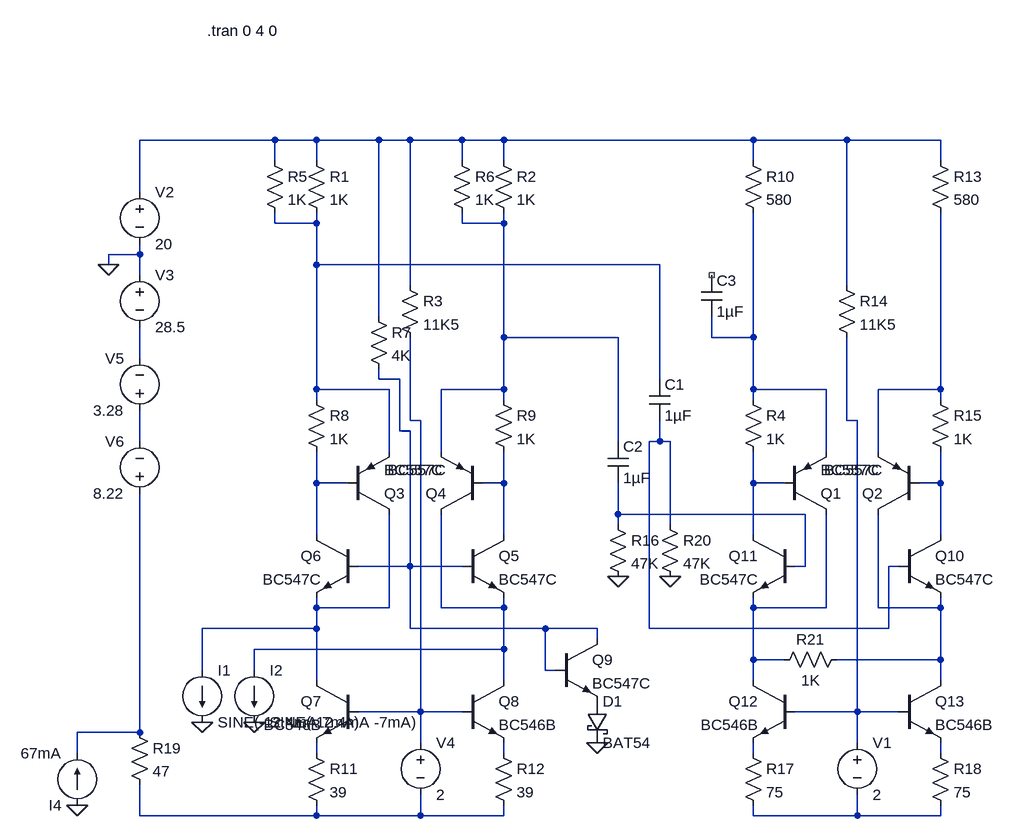
[diagram p0: schematic Untitled.asc]
Untitled.asc, the LTspice schematic file:
Version 4
SHEET 1 1396 1156
WIRE 96 32 -112 32
WIRE 160 32 96 32
WIRE 256 32 160 32
WIRE 304 32 256 32
WIRE 384 32 304 32
WIRE 448 32 384 32
WIRE 832 32 448 32
WIRE 976 32 832 32
WIRE 1120 32 976 32
WIRE 96 64 96 32
WIRE 160 64 160 32
WIRE 384 64 384 32
WIRE 448 64 448 32
WIRE 832 64 832 32
WIRE 1120 64 1120 32
WIRE -112 112 -112 32
WIRE 96 160 96 144
WIRE 160 160 160 144
WIRE 160 160 96 160
WIRE 384 160 384 144
WIRE 448 160 448 144
WIRE 448 160 384 160
WIRE -112 208 -112 192
WIRE -112 208 -160 208
WIRE -160 224 -160 208
WIRE 160 224 160 160
WIRE 688 224 160 224
WIRE -112 240 -112 208
WIRE 304 256 304 32
WIRE 976 256 976 32
WIRE 256 304 256 32
WIRE 448 336 448 160
WIRE 624 336 448 336
WIRE 768 336 768 304
WIRE 832 336 832 144
WIRE 832 336 768 336
WIRE -112 368 -112 320
WIRE 256 400 256 384
WIRE 288 400 256 400
WIRE 688 400 688 224
WIRE 160 416 160 224
WIRE 272 416 160 416
WIRE 448 416 448 336
WIRE 448 416 352 416
WIRE 832 416 832 336
WIRE 944 416 832 416
WIRE 1120 416 1120 144
WIRE 1120 416 1024 416
WIRE 160 432 160 416
WIRE 448 432 448 416
WIRE 832 432 832 416
WIRE 1120 432 1120 416
WIRE 304 464 304 336
WIRE 320 464 304 464
WIRE 976 464 976 336
WIRE 992 464 976 464
WIRE 288 480 288 400
WIRE 304 480 288 480
WIRE -112 496 -112 448
WIRE 624 496 624 336
WIRE 688 496 688 464
WIRE 688 496 672 496
WIRE 704 496 688 496
WIRE 272 512 272 416
WIRE 352 512 352 416
WIRE 944 512 944 416
WIRE 1024 512 1024 416
WIRE 160 560 160 512
WIRE 208 560 160 560
WIRE 448 560 448 512
WIRE 448 560 416 560
WIRE 832 560 832 512
WIRE 880 560 832 560
WIRE 1120 560 1120 512
WIRE 1120 560 1088 560
WIRE 624 608 624 560
WIRE 912 608 624 608
WIRE 624 624 624 608
WIRE 704 624 704 496
WIRE 160 640 160 560
WIRE 448 640 448 560
WIRE 832 640 832 560
WIRE 1120 640 1120 560
WIRE 304 688 304 480
WIRE 304 688 224 688
WIRE 384 688 304 688
WIRE 912 688 912 608
WIRE 912 688 896 688
WIRE 1056 688 1040 688
WIRE 160 752 160 736
WIRE 272 752 272 608
WIRE 272 752 160 752
WIRE 352 752 352 608
WIRE 448 752 448 736
WIRE 448 752 352 752
WIRE 832 752 832 736
WIRE 944 752 944 608
WIRE 944 752 832 752
WIRE 1024 752 1024 608
WIRE 1120 752 1120 736
WIRE 1120 752 1024 752
WIRE 160 784 160 752
WIRE 160 784 -16 784
WIRE 304 784 304 688
WIRE 512 784 304 784
WIRE 592 784 512 784
WIRE 672 784 672 496
WIRE 1040 784 1040 688
WIRE 1040 784 672 784
WIRE 592 800 592 784
WIRE 448 816 448 752
WIRE 448 816 64 816
WIRE 832 832 832 752
WIRE 880 832 832 832
WIRE 1120 832 1120 752
WIRE 1120 832 960 832
WIRE -16 848 -16 784
WIRE 64 848 64 816
WIRE 512 848 512 784
WIRE 528 848 512 848
WIRE 160 864 160 784
WIRE 448 864 448 816
WIRE 832 864 832 832
WIRE 1120 864 1120 832
WIRE 320 912 320 464
WIRE 320 912 224 912
WIRE 384 912 320 912
WIRE 992 912 992 464
WIRE 992 912 896 912
WIRE 1056 912 992 912
WIRE -112 944 -112 576
WIRE -112 944 -208 944
WIRE 320 960 320 912
WIRE 992 960 992 912
WIRE -208 976 -208 944
WIRE 160 976 160 960
WIRE 448 976 448 960
WIRE 832 976 832 960
WIRE 1120 976 1120 960
WIRE -112 1072 -112 1024
WIRE 160 1072 160 1056
WIRE 160 1072 -112 1072
WIRE 320 1072 320 1040
WIRE 320 1072 160 1072
WIRE 448 1072 448 1056
WIRE 448 1072 320 1072
WIRE 832 1072 832 1056
WIRE 992 1072 992 1040
WIRE 992 1072 832 1072
WIRE 1120 1072 1120 1056
WIRE 1120 1072 992 1072
FLAG -160 224 0
FLAG -16 928 0
FLAG 64 928 0
FLAG 592 960 0
FLAG 624 704 0
FLAG 704 704 0
FLAG -208 1056 0
SYMBOL res 144 48 R0
SYMATTR InstName R1
SYMATTR Value 1K
SYMBOL res 432 48 R0
SYMATTR InstName R2
SYMATTR Value 1K
SYMBOL res 288 240 R0
SYMATTR InstName R3
SYMATTR Value 11K5
SYMBOL voltage -112 96 R0
SYMATTR InstName V2
SYMATTR Value 20
SYMBOL voltage -112 224 R0
SYMATTR InstName V3
SYMATTR Value 28.5
SYMBOL res 144 416 R0
SYMATTR InstName R8
SYMATTR Value 1K
SYMBOL res 432 416 R0
SYMATTR InstName R9
SYMATTR Value 1K
SYMBOL pnp 208 608 M180
SYMATTR InstName Q3
SYMATTR Value BC557C
SYMBOL pnp 416 608 R180
SYMATTR InstName Q4
SYMATTR Value BC557C
SYMBOL npn 384 640 R0
SYMATTR InstName Q5
SYMATTR Value BC547C
SYMBOL npn 224 640 M0
SYMATTR InstName Q6
SYMATTR Value BC547C
SYMBOL npn 224 864 M0
SYMATTR InstName Q7
SYMATTR Value BC546B
SYMBOL npn 384 864 R0
SYMATTR InstName Q8
SYMATTR Value BC546B
SYMBOL res 144 960 R0
SYMATTR InstName R11
SYMATTR Value 39
SYMBOL res 432 960 R0
SYMATTR InstName R12
SYMATTR Value 39
SYMBOL voltage 320 944 R0
SYMATTR InstName V4
SYMATTR Value 2
SYMBOL current -16 848 R0
WINDOW 123 0 0 Left 2
WINDOW 39 0 0 Left 2
SYMATTR InstName I1
SYMATTR Value SINE(-12.4mA 7mA)
SYMBOL current 64 848 R0
WINDOW 123 0 0 Left 2
WINDOW 39 0 0 Left 2
SYMATTR InstName I2
SYMATTR Value SINE(-12.4mA -7mA)
SYMBOL npn 528 800 R0
SYMATTR InstName Q9
SYMATTR Value BC547C
SYMBOL schottky 576 896 R0
SYMATTR InstName D1
SYMATTR Value BAT54
SYMATTR Description Diode
SYMATTR Type diode
SYMBOL res 80 48 R0
SYMATTR InstName R5
SYMATTR Value 1K
SYMBOL res 368 48 R0
SYMATTR InstName R6
SYMATTR Value 1K
SYMBOL res 240 288 R0
SYMATTR InstName R7
SYMATTR Value 4K
SYMBOL res 816 48 R0
SYMATTR InstName R10
SYMATTR Value 580
SYMBOL res 1104 48 R0
SYMATTR InstName R13
SYMATTR Value 580
SYMBOL res 960 240 R0
SYMATTR InstName R14
SYMATTR Value 11K5
SYMBOL npn 896 864 M0
SYMATTR InstName Q12
SYMATTR Value BC546B
SYMBOL npn 1056 864 R0
SYMATTR InstName Q13
SYMATTR Value BC546B
SYMBOL res 816 960 R0
SYMATTR InstName R17
SYMATTR Value 75
SYMBOL res 1104 960 R0
SYMATTR InstName R18
SYMATTR Value 75
SYMBOL voltage 992 944 R0
SYMATTR InstName V1
SYMATTR Value 2
SYMBOL res 976 816 R90
WINDOW 0 0 56 VBottom 2
WINDOW 3 32 56 VTop 2
SYMATTR InstName R21
SYMATTR Value 1K
SYMBOL res -128 928 R0
SYMATTR InstName R19
SYMATTR Value 47
SYMBOL res 816 416 R0
SYMATTR InstName R4
SYMATTR Value 1K
SYMBOL res 1104 416 R0
SYMATTR InstName R15
SYMATTR Value 1K
SYMBOL pnp 880 608 M180
SYMATTR InstName Q1
SYMATTR Value BC557C
SYMBOL pnp 1088 608 R180
SYMATTR InstName Q2
SYMATTR Value BC557C
SYMBOL npn 1056 640 R0
SYMATTR InstName Q10
SYMATTR Value BC547C
SYMBOL npn 896 640 M0
SYMATTR InstName Q11
SYMATTR Value BC547C
SYMBOL cap 672 400 R0
SYMATTR InstName C1
SYMATTR Value 1µF
SYMBOL cap 608 496 R0
SYMATTR InstName C2
SYMATTR Value 1µF
SYMBOL res 608 608 R0
SYMATTR InstName R16
SYMATTR Value 47K
SYMBOL res 688 608 R0
SYMATTR InstName R20
SYMATTR Value 47K
SYMBOL cap 752 240 R0
SYMATTR InstName C3
SYMATTR Value 1µF
SYMBOL voltage -112 464 R180
WINDOW 0 24 96 Left 2
WINDOW 3 24 16 Left 2
SYMATTR InstName V5
SYMATTR Value 3.28
SYMBOL voltage -112 592 R180
WINDOW 0 24 96 Left 2
WINDOW 3 24 16 Left 2
SYMATTR InstName V6
SYMATTR Value 8.22
SYMBOL current -208 1056 R180
WINDOW 123 0 0 Left 2
WINDOW 39 0 0 Left 2
SYMATTR InstName I4
SYMATTR Value 67mA
TEXT -8 -136 Left 2 !.tran 0 4 0

The netlist it stands for:
* Untitled.asc
R1 N001 N002 1K
R2 N001 N003 1K
R3 N001 N008 11K5
V2 N001 0 20
V3 0 N005 28.5
R8 N002 N012 1K
R9 N003 N013 1K
Q3 N017 N012 N002 0 BC557C
Q4 N018 N013 N003 0 BC557C
Q5 N013 N006 N018 0 BC547C
Q6 N012 N006 N017 0 BC547C
Q7 N017 N008 N022 0 BC546B
Q8 N018 N008 N023 0 BC546B
R11 N022 N026 39
R12 N023 N026 39
V4 N008 N026 2
I1 N017 0 SINE(-12.4mA 7mA)
I2 N018 0 SINE(-12.4mA -7mA)
Q9 N006 N006 P001 0 BC547C
D1 P001 0 BAT54
R5 N001 N002 1K
R6 N001 N003 1K
R7 N001 N006 4K
R10 N001 N004 580
R13 N001 N007 580
R14 N001 N009 11K5
Q12 N019 N009 N024 0 BC546B
Q13 N020 N009 N025 0 BC546B
R17 N024 N027 75
R18 N025 N027 75
V1 N009 N027 2
R21 N020 N019 1K
R19 N021 N026 47
R4 N004 N014 1K
R15 N007 N015 1K
Q1 N019 N014 N004 0 BC557C
Q2 N020 N015 N007 0 BC557C
Q10 N015 N011 N020 0 BC547C
Q11 N014 N016 N019 0 BC547C
C1 N002 N011 1µF
C2 N003 N016 1µF
R16 N016 0 47K
R20 N011 0 47K
C3 NC_01 N004 1µF
V5 N010 N005 3.28
V6 N021 N010 8.22
I4 0 N021 67mA
.model D D
.lib standard.dio
.model NPN NPN
.model PNP PNP
.lib standard.bjt
.tran 0 4 0
.backanno
.end